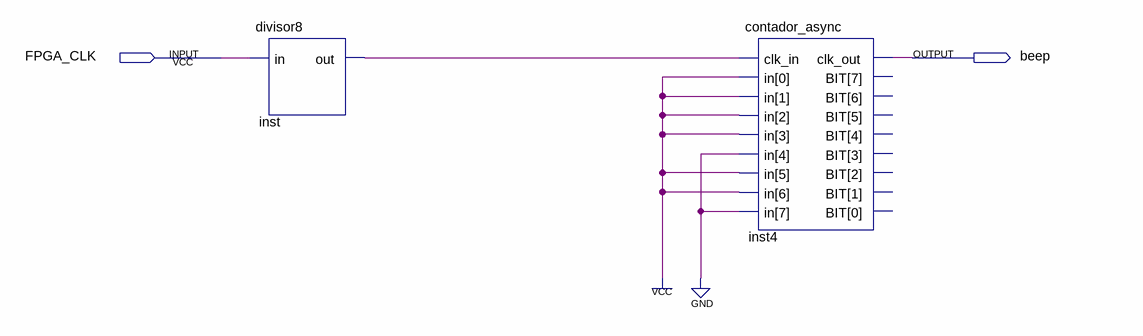
[diagram p0: schematic sheet]
// Quartus schematic buzzer_880hz.bdf as structural Verilog: 2 symbols, 2 pins
module buzzer_880hz (
  input  FPGA_CLK,
  output beep
);

  wire inst_out;

  divisor8 inst (.in(FPGA_CLK), .out(inst_out));
  contador_async inst4 (.clk_in(inst_out), .in(8'b01101111), .clk_out(beep));  // open: BIT
endmodule
